# Altium schematic sheet EtherWiz_A4.SchDoc
size A3; SheetNumber: 2; SheetTotal: 3
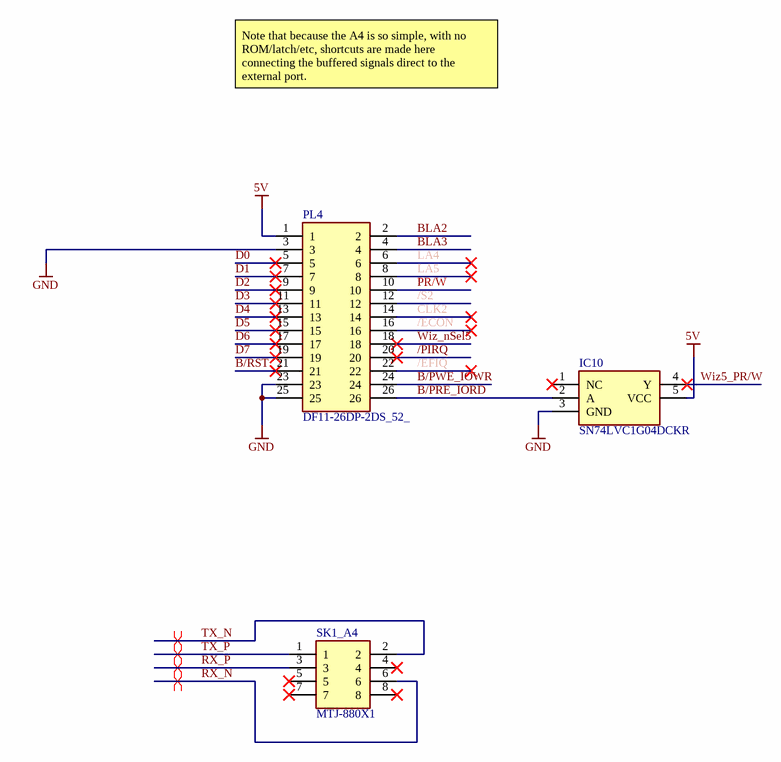
[diagram p0: EtherWiz_A4.SchDoc]

## Parts
IC10  SN74LVC1G04DCKR  [SOT65P210X110-5N]
PL4  DF11-26DP-2DS_52_  [SHDRRA26W50P200_2X13_2800X1000X500P]
SK1_A4  MTJ-880X1  [MTJ880X1]

## Nets
5V: IC10.5(VCC) PL4.1
GND: IC10.3(GND) PL4.3 PL4.23 PL4.25
/ECON: PL4.16
/EFIQ: PL4.22
/PIRQ: PL4.20
/S2: PL4.12
B/PRE_IORD: IC10.2(A) PL4.26
B/PWE_IOWR: PL4.24
B/RST: PL4.21
BLA2: PL4.2
BLA3: PL4.4
CLK2: PL4.14
D0: PL4.5
D1: PL4.7
D2: PL4.9
D3: PL4.11
D4: PL4.13
D5: PL4.15
D6: PL4.17
D7: PL4.19
LA4: PL4.6
LA5: PL4.8
PR/W: PL4.10
RX_N: SK1_A4.6
RX_P: SK1_A4.3
TX_N: SK1_A4.2
TX_P: SK1_A4.1
Wiz5_PR/W: IC10.4(Y)
Wiz_nSel5: PL4.18

Not connected (* = marked no-connect by the designer): IC10 1(NC)*; SK1_A4 4* 5* 7* 8*

## Layout directives
differential pair: RX_N, RX_P, TX_N, TX_P

## Notes on the sheet
- Note that because the A4 is so simple, with no ROM/latch/etc, shortcuts are made here connecting the buffered signals direct to the external port.
- SIZE
- DIMENSIONS
- TITLE
- VARIANT
- REVISION
- DATE
- A3
- SHEET
- OF
- FILE
- DRAWN BY

## Library data of the parts
IC10 = SN74LVC1G04DCKR: Integrated Circuit; Manufacturer_Name: Texas Instruments; Datasheet Link: http://www.ti.com/lit/ds/symlink/sn74lvc1g04.pdf; Height: 1.1mm; Manufacturer_Part_Number: SN74LVC1G04DCKR; Mouser Part Number: 595-SN74LVC1G04DCKR; Mouser Price/Stock: https://www.mouser.co.uk/ProductDetail/Texas-Instruments/SN74LVC1G04DCKR?qs=dT9u2OTAaVWNPsQmeXyvkg%3D%3D; Arrow Part Number: SN74LVC1G04DCKR; Arrow Price/Stock: https://www.arrow.com/en/products/sn74lvc1g04dckr/texas-instruments?region=nac
PL4 = DF11-26DP-2DS_52_: Connector; Manufacturer_Name: Hirose; Manufacturer_Part_Number: DF11-26DP-2DS(52); Datasheet Link: https://www.hirose.com/product/document?clcode=CL0543-0544-8-52&productname=DF11-26DP-2DS(52)&series=DF11&documenttype=2DDrawing&lang=en&documentid=0000995291; Height: 5mm; Mouser Part Number: 798-DF11-26DP-2DS52; Mouser Price/Stock: https://www.mouser.co.uk/ProductDetail/Hirose-Connector/DF11-26DP-2DS52?qs=Ux3WWAnHpjAoQVMFZWdmwg%3D%3D; Arrow Part Number: DF11-26DP-2DS(52); Arrow Price/Stock: https://www.arrow.com/en/products/df11-26dp-2ds-52/hirose-electric
SK1_A4 = MTJ-880X1: Connector; Manufacturer_Name: Adam Tech; Datasheet Link: https://app.adam-tech.com/products/download/data_sheet/203795/mtj-880x1-data-sheet.pdf; Height: 12.9794mm; Manufacturer_Part_Number: MTJ-880X1; Mouser Part Number: 737-MTJ-880X1; Mouser Price/Stock: https://www.mouser.co.uk/ProductDetail/Adam-Tech/MTJ-880X1?qs=TTVbHWoAP%2FTHQFSSStritA%3D%3D; Arrow Part Number: MTJ-880X1; Arrow Price/Stock: https://www.arrow.com/en/products/mtj-880x1/adam-tech?region=nac